# Altium schematic sheet SH3 - NUCLEO HEADERS.SchDoc
size A4
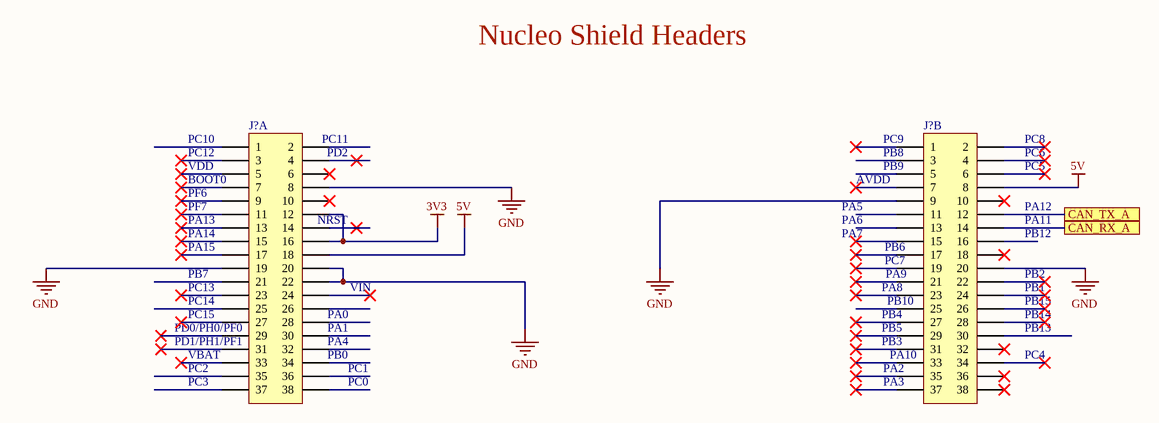
[diagram p0: SH3 - NUCLEO HEADERS.SchDoc]

## Parts
(Parts that share a designator on the sheet are numbered #1, #2 ... from top to bottom, then left to right.)
J?#1  HEADER_NUCLEO  [HEADER_NUCLEO]  (value not drawn)  (part A of 2)
J?#2  HEADER_NUCLEO  [HEADER_NUCLEO]  (value not drawn)  (part B of 2)

## Ports
CAN_RX_A, CAN_TX_A

## Nets
3V3: J?#1.12 J?#1.16
5V: J?#1.18 J?#2.46(8)
GND: J?#1.8 J?#1.19 J?#1.20 J?#1.22 J?#2.47(9) J?#2.58(20)
CAN_RX_A: J?#2.52(14) ; port CAN_RX_A
CAN_TX_A: J?#2.50(12) ; port CAN_TX_A

Not connected (* = marked no-connect by the designer): J?#1 1 2 3* 4* 5* 6* 7* 9* 10* 11* 13* 14* 15* 17* 21 23* 24* 25 26 27* 28 29* 30 31* 32 33* 34 35 36 37 38; J?#2 39(1)* 40(2)* 41(3) 42(4)* 43(5) 44(6)* 45(7)* 48(10)* 49(11) 51(13) 53(15)* 54(16) 55(17)* 56(18)* 57(19)* 59(21)* 60(22)* 61(23)* 62(24)* 63(25) 64(26)* 65(27)* 66(28)* 67(29)* 68(30) 69(31)* 70(32)* 71(33)* 72(34)* 73(35)* 74(36)* 75(37)* 76(38)*

## Notes on the sheet
- Nucleo Shield Headers
- (near J?#1) PC10
- (near J?#1) PC11
- (near J?#2) PC9
- (near J?#2) PC8
- (near J?#1) PC12
- (near J?#1) BOOT0
- (near J?#1) PF7
- (near J?#1) PF6
- (near J?#1) VDD
- (near J?#1) PD2
- (near J?#2) AVDD
- (near J?#2) PA5
- (near J?#2) PB8
- (near J?#2) PB9
- (near J?#2) PC6
- (near J?#2) PC5
- (near J?#2) PA12
- (near J?#1) PA13
- (near J?#1) PA14
- (near J?#1) PA15
- (near J?#1) PB7
- (near J?#1) NRST
- (near J?#2) PA6
- (near J?#2) PA7
- (near J?#2) PB6
- (near J?#2) PC7
- (near J?#2) PA9
- (near J?#2) PA11
- (near J?#2) PB12
- (near J?#2) PB2
- (near J?#1) PD0/PH0/PF0
- (near J?#1) PD1/PH1/PF1
- (near J?#1) PC13
- (near J?#1) PC14
- (near J?#1) PC15
- (near J?#1) PA0
- (near J?#1) PA1
- (near J?#1) PA4
- (near J?#1) VIN
- (near J?#2) PA8
- (near J?#2) PB4
- (near J?#2) PB5
- (near J?#2) PB3
- (near J?#2) PB10
- (near J?#2) PB1
- (near J?#2) PB15
- (near J?#2) PB14
- (near J?#2) PB13
- (near J?#1) PC2
- (near J?#1) PC3
- (near J?#1) VBAT
- (near J?#1) PB0
- (near J?#1) PC1
- (near J?#1) PC0
- (near J?#2) PA2
- (near J?#2) PA3
- (near J?#2) PA10
- (near J?#2) PC4

## Library data of the parts
J?#1 J?#2 = HEADER_NUCLEO: CONN HDR 38POS 0.1 GOLD PCB; Manufacturer 1: Sullins; Manufacturer Part Number 1: PPPC192LFBN-RC; Package/Footprint: TH; Supplier 1: Digi-Key; Supplier Part Number 1: S7122-ND; Mounting Type: TH; Verified: No; LCSC Part #: *